# EAGLE schematic c116-vclfo (EAGLE 7.6.0)
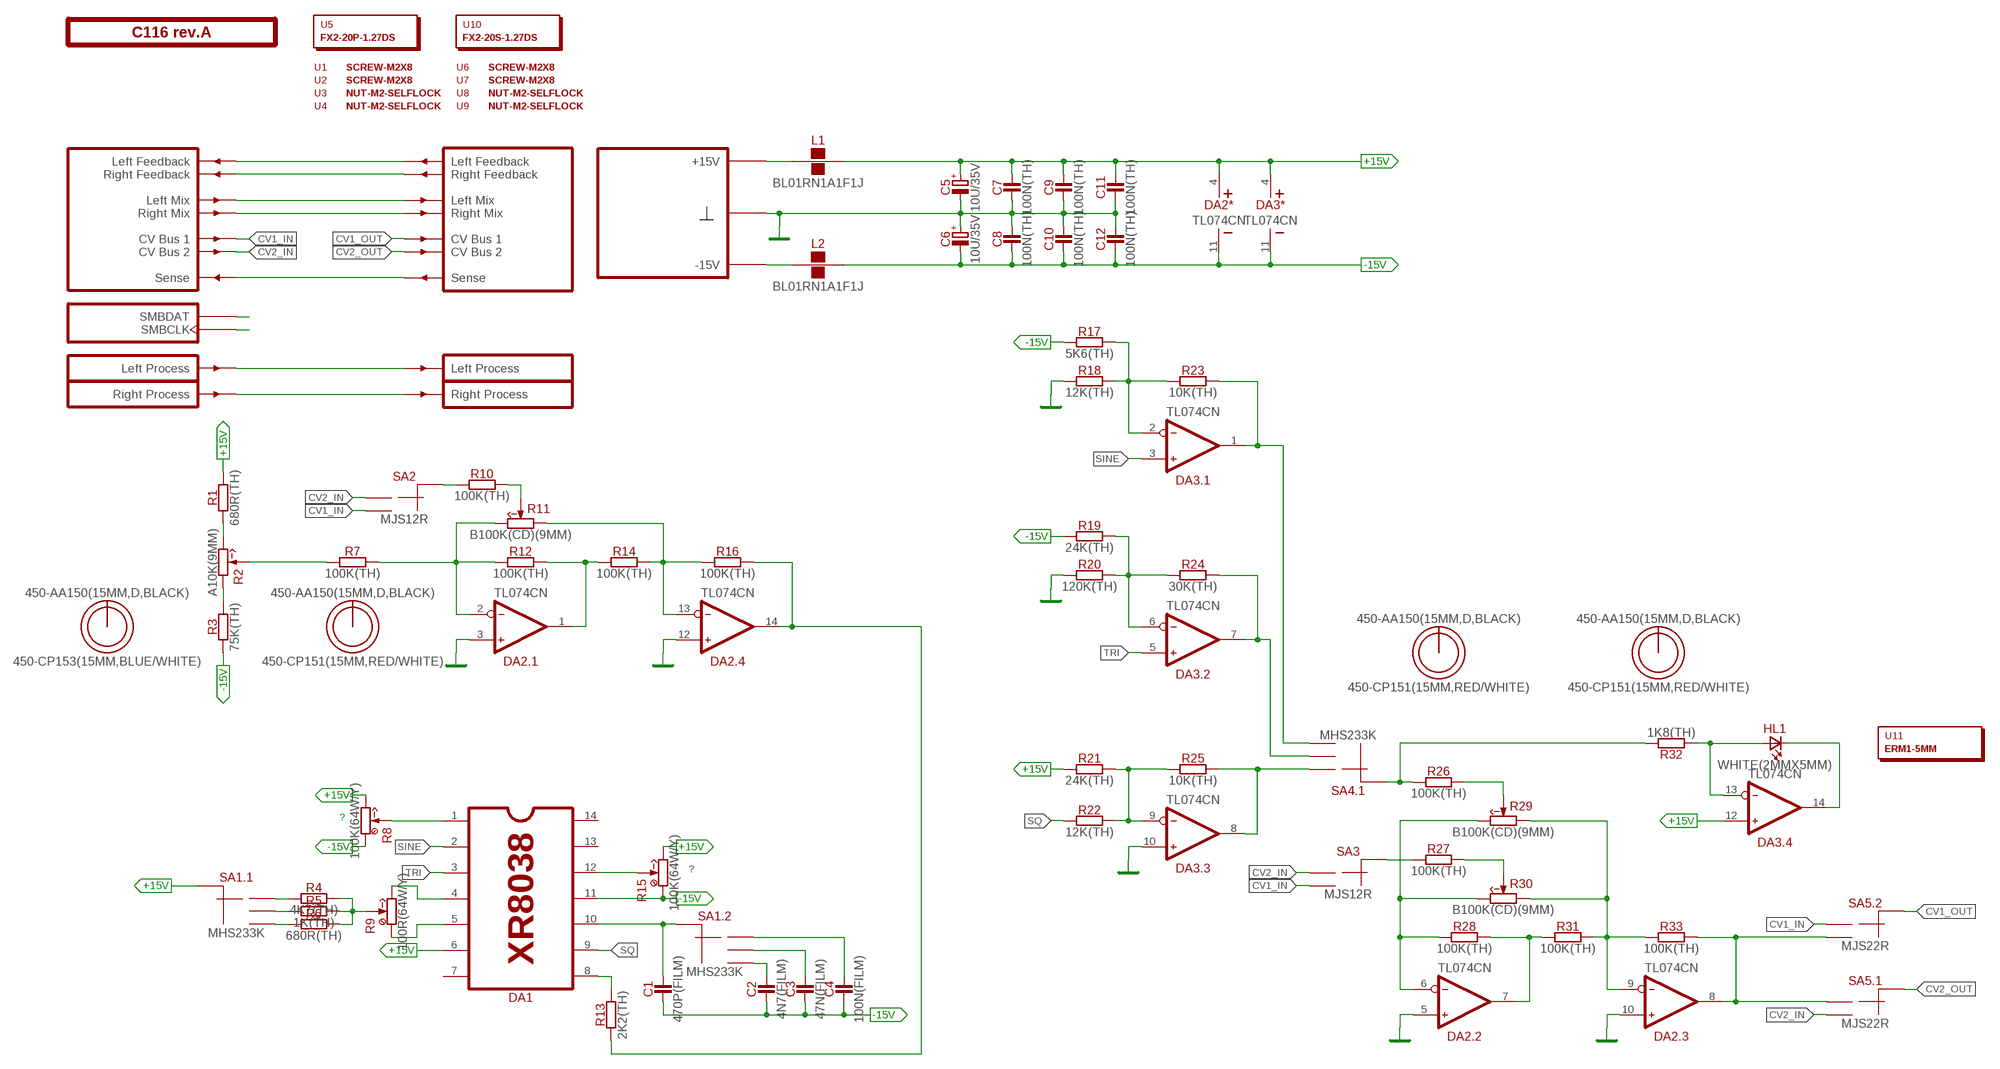
[diagram p0: schematic, sheet 1]

## Parts
C1  470P(FILM)  [C050-055X075]
C2  4N7(FILM)  [C050-025X075]
C3  47N(FILM)  [C050-025X075]
C4  100N(FILM)  [C050-025X075]
C5  10U/35V  [E2-5]
C6  10U/35V  [E2-5]
C7  100N(TH)  [C050-024X044]
C8  100N(TH)  [C050-024X044]
C9  100N(TH)  [C050-024X044]
C10  100N(TH)  [C050-024X044]
C11  100N(TH)  [C050-024X044]
C12  100N(TH)  [C050-024X044]
DA1  XR8038  [DIP-14]
DA2  TL074CN  [DIP-14]
DA3  TL074CN  [DIP-14]
HL1  WHITE(2MMX5MM)  [LED2X5]
L1  BL01RN1A1F1J  [BL01RN1A]
L2  BL01RN1A1F1J  [BL01RN1A]
O1  450-AA150(15MM,D,BLACK)  [EMPTY]
O2  450-CP153(15MM,BLUE/WHITE)  [EMPTY]
O3  450-AA150(15MM,D,BLACK)  [EMPTY]
O4  450-CP151(15MM,RED/WHITE)  [EMPTY]
O5  450-AA150(15MM,D,BLACK)  [EMPTY]
O6  450-CP151(15MM,RED/WHITE)  [EMPTY]
O7  450-AA150(15MM,D,BLACK)  [EMPTY]
O8  450-CP151(15MM,RED/WHITE)  [EMPTY]
PCB1  C116 rev.A  ST2-BOARD-74  [ST2-BOARD-74]
R1  680R(TH)  [R-0207/10]
R2  A10K(9MM)  [RV09-SINGLE]
R3  75K(TH)  [R-0207/10]
R4  4K7(TH)  [R-0207/10]
R5  1K(TH)  [R-0207/10]
R6  680R(TH)  [R-0207/10]
R7  100K(TH)  [R-0207/10]
R8  100K(64W/Y)  [64W]
R9  100R(64W/Y)  [64W]
R10  100K(TH)  [R-0207/10]
R11  B100K(CD)(9MM)  [RV09-SINGLE]
R12  100K(TH)  [R-0207/10]
R13  2K2(TH)  [R-0207/10]
R14  100K(TH)  [R-0207/10]
R15  100K(64W/Y)  [64W]
R16  100K(TH)  [R-0207/10]
R17  5K6(TH)  [R-0207/10]
R18  12K(TH)  [R-0207/10]
R19  24K(TH)  [R-0207/10]
R20  120K(TH)  [R-0207/10]
R21  24K(TH)  [R-0207/10]
R22  12K(TH)  [R-0207/10]
R23  10K(TH)  [R-0207/10]
R24  30K(TH)  [R-0207/10]
R25  10K(TH)  [R-0207/10]
R26  100K(TH)  [R-0207/10]
R27  100K(TH)  [R-0207/10]
R28  100K(TH)  [R-0207/10]
R29  B100K(CD)(9MM)  [RV09-SINGLE]
R30  B100K(CD)(9MM)  [RV09-SINGLE]
R31  100K(TH)  [R-0207/10]
R32  1K8(TH)  [R-0207/10]
R33  100K(TH)  [R-0207/10]
SA1  MHS233K  [APEM-MHS233K]
SA2  MJS12R  [APEM-MJS12R]
SA3  MJS12R  [APEM-MJS12R]
SA4  MHS233K  [APEM-MHS233K]
SA5  MJS22R  [APEM-MJS22R]
U1  SCREW-M2X8  [EMPTY]
U2  SCREW-M2X8  [EMPTY]
U3  NUT-M2-SELFLOCK  [EMPTY]
U4  NUT-M2-SELFLOCK  [EMPTY]
U5  FX2-20P-1.27DS  [EMPTY]
U6  SCREW-M2X8  [EMPTY]
U7  SCREW-M2X8  [EMPTY]
U8  NUT-M2-SELFLOCK  [EMPTY]
U9  NUT-M2-SELFLOCK  [EMPTY]
U10  FX2-20S-1.27DS  [EMPTY]
U11  ERM1-5MM  [EMPTY]

## Nets
+15V: C5.+ C7.2 C9.2 C11.2 DA1.6 DA2.4(*:V+) DA3.4(*:V+) DA3.12(.4:IN+) L1.2 R1.2 R8.3(CW) R15.3(CW) R21.1 SA1.CMN(.1:CM)
-15V: C1.1 C2.1 C3.1 C4.1 C6.- C8.1 C10.1 C12.1 DA1.11 DA2.11(*:V-) DA3.11(*:V-) L2.2 R3.1 R8.1(CCW) R15.1(CCW) R17.1 R19.1
CV1_IN: PCB1.ACV1(CV1) SA2.NO SA3.NO SA5.NC2
CV1_OUT: PCB1.ACV1'(CV1') SA5.C2(.2:CM)
CV2_IN: PCB1.ACV2(CV2) SA2.NC SA3.NC SA5.NO1
CV2_OUT: PCB1.ACV2'(CV2') SA5.C1(.1:CM)
GND: C5.- C6.+ C7.1 C8.2 C9.1 C10.2 C11.1 C12.2 DA2.3(.1:IN+) DA2.5(.2:IN+) DA2.10(.3:IN+) DA2.12(.4:IN+) DA3.10(.3:IN+) PCB1.B4'(GND) PCB1.B4(GND) PCB1.B5'(GND) PCB1.B5(GND) PCB1.B6'(GND) PCB1.B6(GND) PCB1.B7'(GND) PCB1.B7(GND) PCB1.B8'(GND) PCB1.B8(GND) R18.1 R20.1
LMIX: PCB1.ALMIX'(LMIX') PCB1.ALMIX(LMIX)
N$1: L1.1 PCB1.A+15'(P+15V) PCB1.A+15(P+15V) PCB1.B+15'(P+15V) PCB1.B+15(P+15V)
N$2: PCB1.ALFBK'(LFBK') PCB1.ALFBK(LFBK)
N$3: R10.2 R11.2(W)
N$4: PCB1.ARFBK'(RFBK') PCB1.ARFBK(RFBK)
N$5: DA2.2(.1:IN-) R7.2 R11.3(CW) R12.1
N$6: DA2.1(.1:OUT) R12.2 R14.1
N$7: DA2.13(.4:IN-) R11.1(CCW) R14.2 R16.1
N$8: DA2.14(.4:OUT) R13.1 R16.2
N$9: R10.1 SA2.C(CM)
N$10: PCB1.BINL(INL) PCB1.BOUTL'(OUTL)
N$11: PCB1.BINR(INR) PCB1.BOUTR'(OUTR)
N$12: R2.2(W) R7.1
N$13: R1.1 R2.3(CW)
N$14: R2.1(CCW) R3.2
N$15: DA1.4 R9.3(CW)
N$16: PCB1.BSENSE'(SENSE') PCB1.BSENSE(SENSE)
N$17: DA1.5 R9.1(CCW)
N$18: R4.2 R5.2 R6.2 R9.S(W) R9.S@1(W)
N$19: R4.1 SA1.1
N$20: R5.1 SA1.2
N$21: R6.1 SA1.3
N$22: DA3.8(.3:OUT) R25.2 SA4.1
N$23: C2.2 SA1.3'
N$24: C3.2 SA1.2'
N$25: L2.1 PCB1.A-15'(P-15V) PCB1.A-15(P-15V) PCB1.B-15'(P-15V) PCB1.B-15(P-15V)
N$26: C4.2 SA1.1'
N$27: C1.2 DA1.10 SA1.CMN'(.2:CM)
N$28: DA1.8 R13.2
N$29: DA3.7(.2:OUT) R24.2 SA4.2
N$30: DA1.12 R15.S(W) R15.S@1(W)
N$31: DA1.1 R8.S(W) R8.S@1(W)
N$32: DA3.1(.1:OUT) R23.2 SA4.3
N$33: DA3.2(.1:IN-) R17.2 R18.2 R23.1
N$34: DA3.6(.2:IN-) R19.2 R20.2 R24.1
N$35: DA3.9(.3:IN-) R21.2 R22.2 R25.1
N$36: DA3.13(.4:IN-) HL1.A R32.1
N$37: R27.2 R30.2(W)
N$38: PCB1.ASMBDAT'(SMBDAT) PCB1.ASMBDAT(SMBDAT)
N$41: DA3.14(.4:OUT) HL1.K(C)
N$42: DA2.6(.2:IN-) R28.1 R29.3(CW) R30.3(CW)
N$43: PCB1.ASMBCLK'(SMBCLK) PCB1.ASMBCLK(SMBCLK)
N$44: DA2.7(.2:OUT) R28.2 R31.1
N$45: DA2.9(.3:IN-) R29.1(CCW) R30.1(CCW) R31.2 R33.1
N$46: DA2.8(.3:OUT) R33.2 SA5.NC1 SA5.NO2
N$47: R27.1 SA3.C(CM)
N$48: R26.2 R29.2(W)
N$49: R26.1 R32.2 SA4.CMN(.1:CM)
RMIX: PCB1.ARMIX'(RMIX') PCB1.ARMIX(RMIX)
SINE: DA1.2 DA3.3(.1:IN+)
SQ: DA1.9 R22.1
TRI: DA1.3 DA3.5(.2:IN+)
Unconnected: DA1.7 DA1.13 DA1.14 SA4.1' SA4.2' SA4.3' SA4.CMN'(.2:CM)

## Notes on the sheet
- ?
- ?

## Library data of the parts
C1 C2 = capacitors:?
C3 = capacitors:?; MOUSER: 871-B32529C1473J
C4 = capacitors:?; MOUSER: 505-MKS2.1/63/5
C5 C6 = capacitors-electrolytic:?; MOUSER: 647-USW1V100MDD
C7-C12 = capacitors:?; MOUSER: 81-RCER71H104K0A2H3B
DA1 = ic-exar:XR8038
DA2 DA3 = ic-ti:TL074
HL1 = optoelectronics:?(2MMX5MM)
L1 L2 = inductors:BL01RN1A?; MOUSER: 81-BL01RN1A1F1J
O1 O3 O5 O7 = hardware:450-AA?; MOUSER: 450-AA150
O2 = hardware:450-C?; MOUSER: 450-CP153
O4 O6 O8 = hardware:450-C?
PCB1 = module-footprints:ST2-BOARD-?
R1 R3 R4 R6 R13 R17-R22 R24 R32 = resistors:?
R2 = potentiometers:?; MOUSER: 652-PTV09A4025FA103
R5 = resistors:?; MOUSER: 71-RN55D-F-1.0K
R7 R10 R12 R14 R16 R26-R28 R31 R33 = resistors:?; MOUSER: 71-RN55D-F-100K
R8 R9 R15 = potentiometers:?(64W/Y)
R11 R29 R30 = potentiometers:?; MOUSER: 652-PTV09A-4225FB104
R23 R25 = resistors:?; MOUSER: 71-RN55D-F-10K
SA1 SA4 = switches:MHS233K
SA2 SA3 = switches:MJS12R; MOUSER: 642-MJS12R
SA5 = switches:MJS22R; MOUSER: 642-MJS22R
U1-U4 U6-U9 = hardware:*?
U5 = hardware:?; MOUSER: 798-FX2-20P-1.27DS71
U10 = hardware:?; MOUSER: 798-FX2-20S-1.27DS71
U11 = hardware:?